# EAGLE design ESP 12F 2x8 pinout (EAGLE 7.7.0)
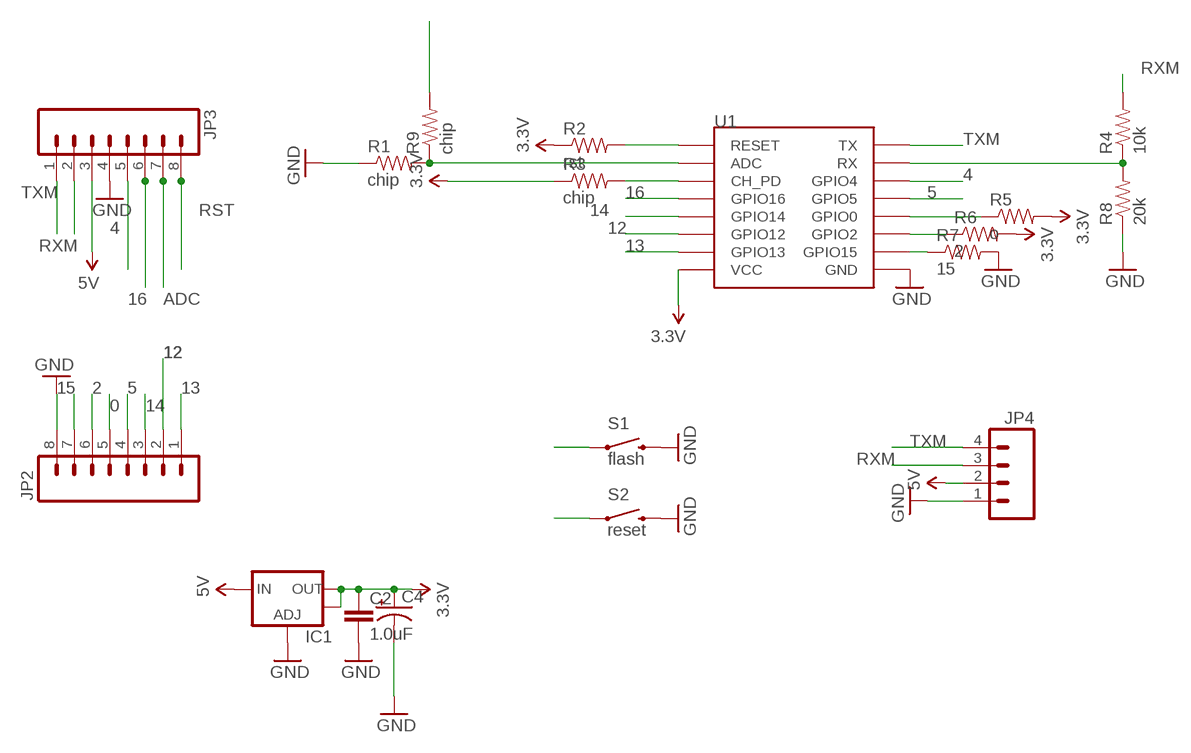
[diagram p0: schematic, sheet 1]

## Parts
C2  1.0uF  1.0UF50V10%(1206)  [1206]
C4  47UF-50V-20%(ELECT)  [PANASONIC_D]
IC1  V_REG_LM1117SOT223  [SOT223]
JP2  M08  [1X08_ROUND]
JP3  M08  [1X08_ROUND]
JP4  M04PTH  [1X04]
R1  chip  0.3OHM-1/8W-1%(0805)  [0805]
R2  rst  0.3OHM-1/8W-1%(0805)  [0805]
R3  chip  0.3OHM-1/8W-1%(0805)  [0805]
R4  10k  0.3OHM-1/8W-1%(0805)  [0805]
R5  o  0.3OHM-1/8W-1%(0805)  [0805]
R6  2  0.3OHM-1/8W-1%(0805)  [0805]
R7  15  0.3OHM-1/8W-1%(0805)  [0805]
R8  20k  0.3OHM-1/8W-1%(0805)  [0805]
R9  chip  0.3OHM-1/8W-1%(0805)  [0805]
S1  flash  SWITCH-MOMENTARY-2SMD-1101NE  [TACTILE-SWITCH-1101NE]
S2  reset  SWITCH-MOMENTARY-2SMD-1101NE  [TACTILE-SWITCH-1101NE]
U1  ESP12SMD  [ESP12-SMD]

## Nets
0: JP2.5 R5.1 S1.1 U1.GPIO0
2: JP2.6 R6.1 U1.GPIO2
3.3V: C2.1 C4.+ IC1.2(OUT) IC1.4(OUT) R2.1 R3.1 R5.2 R6.2 U1.VCC
4: JP3.5 U1.GPIO4
5: JP2.4 U1.GPIO5
5V: IC1.3(IN) JP3.3 JP4.2
12: JP2.2 U1.GPIO12
13: JP2.1 U1.GPIO13
14: JP2.3 U1.GPIO14
15: JP2.7 R7.1 U1.GPIO15
16: JP3.6 U1.GPIO16
ADC: JP3.7 R9.2
ADCM: R1.2 R9.1 U1.ADC
CH_PD: R3.2 U1.CH_PD
GND: C2.2 C4.- IC1.1(ADJ) JP2.8 JP3.4 JP4.1 R1.1 R7.2 R8.1 S1.2 S2.2 U1.GND
N$7: R4.1 R8.2 U1.RXD0(RX)
RST: JP3.8 R2.2 S2.1 U1.RESET
RXM: JP3.2 JP4.3 R4.2
TXM: JP3.1 JP4.4 U1.TXD0(TX)

## Library data of the parts
C2 = SparkFun-Capacitors:1.0UF50V10%(1206): CAP-09822; PROD_ID: CAP-09822
C4 = SparkFun-Capacitors:47UF-50V-20%(ELECT): CAP-10547; PROD_ID: CAP-10547
IC1 = SparkFun-PowerIC:V_REG_LM1117: Voltage Regulator LM1117 Standard adjustable voltage regulator but in SMD form. Spark Fun Electronics SKU : COM-00595; PROD_ID: VREG-08170
JP2 JP3 = SparkFun-Connectors:M08: Header 8 Standard 8-pin 0.1" header. Use with straight break away headers (SKU : PRT-00116), right angle break away headers (PRT-00553), swiss pins (PRT-00743), machine pins (PRT-00117), and female headers (PRT-00115).
JP4 = SparkFun-Connectors:M04: Header 4 Standard 4-pin 0.1" header. Use with straight break away headers (SKU : PRT-00116), right angle break away headers (PRT-00553), swiss pins (PRT-00743), machine pins (PRT-00117), and female headers (PRT-00115). Molex polarized connector foot print use with SKU : PRT-08231 with associated crimp pins and housings. 1MM SMD Version SKU: PRT-10208
R1-R9 = SparkFun-Resistors:0.3OHM-1/8W-1%(0805): RES-11622; PROD_ID: RES-11622; VALUE: 0.3
S1 S2 = SparkFun-Electromechanical:SWITCH-MOMENTARY-2: Various NO switches- pushbuttons, reed, etc; PROD_ID: SWCH-00815
U1 = esp8266modules:ESP12: ESP8266 Wifi module 12

## Board
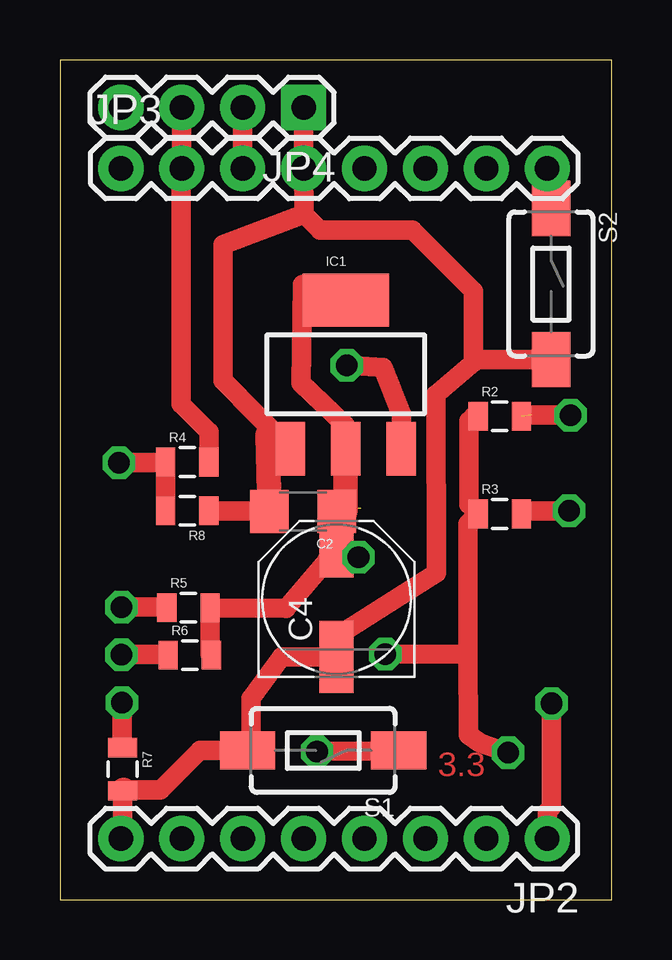
[diagram p1: board, top side]
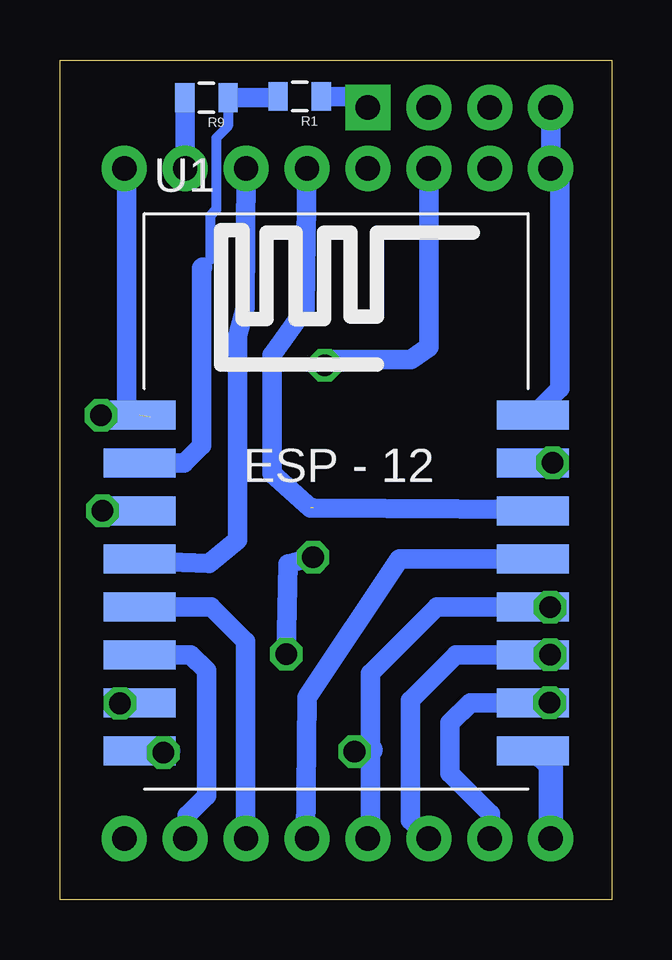
[diagram p2: board, bottom side, seen from below]

Size 23 x 35 mm. Coordinates in mm from the lower left corner, seen from the top.
Outline: 0,0 23,0 23,35 0,35 0,0
Copper layers (1*16): Top 0.035mm / dielectric 1.5mm / Bottom 0.035mm
Design rules "default *": minimum track width 20mil, minimum drill 24mil, track to track 8mil, track to pad 8mil, pad to pad 8mil, via to via 8mil, smd to smd 8mil, copper to edge 40mil, drill to drill 8mil, minimum pad ring 10mil, minimum via ring 8mil, stop-mask expansion 4mil, vias tented up to drill 0mil, thermal gap 10mil

### Footprints (pad centres in the part's own frame; a part is rotated, then mirrored left to right if it is on the bottom)
1206 = smd 1.6 x 1.8: 1 -1.4,0; 2 1.4,0
PANASONIC_D = smd 3 x 1.4: + 2.4,0; - -2.4,0
SOT223 = smd 1.219 x 2.235: 1 -2.311,-3.099; 2 0,-3.099; 3 2.311,-3.099 | smd 3.6 x 2.2: 4 0,3.099
1X08_ROUND = drill 1.016 pad 1.88: 1 0,0; 2 2.54,0; 3 5.08,0; 4 7.62,0; 5 10.16,0; 6 12.7,0; 7 15.24,0; 8 17.78,0
1X04 = drill 1.016 pad 1.88 square: 1 0,0 | drill 1.016 pad 1.88: 2 2.54,0; 3 5.08,0; 4 7.62,0
0805 = smd 0.8 x 1.2: 1 -0.9,0; 2 0.9,0
TACTILE-SWITCH-1101NE = smd 2.3 x 1.6: 1 -3.15,0; 2 3.15,0
ESP12-SMD = smd 3 x 1.2: ADC -8.3,3.8; CH_PD -8.3,1.8; GND 8.1,-8.2; GPIO0 8.1,-2.2; GPIO2 8.1,-4.2; GPIO4 8.1,1.8; GPIO5 8.1,-0.2; GPIO12 -8.3,-4.2; GPIO13 -8.3,-6.2; GPIO14 -8.3,-2.2; GPIO15 8.1,-6.2; GPIO16 -8.3,-0.2; RESET -8.3,5.8; RXD0 8.1,3.8; TXD0 8.1,5.8; VCC -8.3,-8.2

### Placement (x,y rotation side)
C2  10.13,16.18 180 top
C4  11.53,12.52 90 top
IC1  11.91,21.89 0 top
JP2  20.32,2.54 180 top
JP3  2.54,30.48 0 top
JP4  10.16,33.02 180 top
R1  13,33.48 180 bottom
R2  18.34,20.14 0 top
R3  18.34,16.08 0 top
R4  5.31,18.24 0 top
R5  5.36,12.17 0 top
R6  5.41,10.19 0 top
R7  2.62,5.44 270 top
R8  5.31,16.21 180 top
R9  16.89,33.43 180 bottom
S1  10.98,6.22 180 top
S2  20.47,25.66 270 top
U1  11.38,14.4 0 bottom

### Tracks (layer width: path | path; a pad name or v marks a point on that pad's centre or on a via)
0  (via drill 0.9)
  Top 0.813: v2.56,12.19 4.43,12.19 R5.1 | v10.72,6.17 14.11,6.2
  Top 1.016: 14.11,6.2 S1.1
  Bottom 0.813: JP2.5 10.06,2.64 10.06,6.25 10.06,9.42 7.28,12.2 U1.GPIO0 2.58,12.2 v2.56,12.19 | 10.72,6.25 v10.72,6.17
  Bottom 1.016: 10.06,6.25 10.72,6.25
2  (via drill 0.9)
  Top 0.813: v2.56,10.21 4.49,10.21 R6.1
  Bottom 0.813: JP2.6 8.38,3.3 8.38,8.31 6.49,10.2 U1.GPIO2 v2.57,10.2 v2.56,10.21
3.3V  (via drill 0.9)
  Top 0.813: v18.69,6.12 17.5,6.53 17.03,6.87 17.02,10.21 | R2.1 17.25,20.14 17.04,19.94 17.04,16.47 R3.1 17.44,16.07 17.02,15.65 17.02,10.21 | R6.2 6.26,10.24 R5.2 9.42,12.14 11.11,14.11 C4.+ 11.42,14.21 v12.45,14.28 | IC1.2 11.89,19.79 10.06,21.54 10.11,25.63 IC1.4 | v13.56,10.24 17.02,10.21
  Top 1.016: IC1.2 11.91,16.26 | 11.91,16.26 C2.1 | 11.91,16.26 11.89,16.12 C4.+
  Bottom 0.813: U1.VCC 18.39,6.2 v18.69,6.12 | v12.45,14.28 13.49,13.99 v13.56,10.24
4  (1 unrouted)
  Bottom 0.813: 12.42,16.33 3.33,16.26 | JP3.5 12.78,24.61 14.15,22.71 14.15,17.75 12.55,16.33
  Bottom 1.016: 3.33,16.26 U1.GPIO4
5
  Bottom 0.813: U1.GPIO5 8.84,14.2 12.7,8.43 12.75,2.59
  Bottom 1.016: 12.75,2.59 JP2.4
5V  (via drill 0.9)
  Top 0.813: JP4.2 JP3.3 | IC1.3 14.25,18.82 14.25,20.22 13.46,22.17 v11.96,22.28
  Bottom 0.813: JP3.3 7.62,23.04 8.36,22.5 11.89,22.5 v11.96,22.28
12
  Bottom 0.813: U1.GPIO12 17.54,10.2 16.89,9.55 16.89,4.32 17.7,3.5 17.7,2.62 JP2.2
13  (via drill 0.9)
  Top 0.813: JP2.1 20.32,3.66 20.5,3.83 v20.5,8.18
  Bottom 1.016: U1.GPIO13 20.3,8.2 v20.5,8.18
14
  Bottom 0.813: U1.GPIO14 16.7,12.2 15.27,10.77 15.27,2.56
  Bottom 1.016: 15.27,2.56 JP2.3
15  (via drill 0.9)
  Top 0.813: v2.59,8.2 2.59,6.36 R7.1
  Bottom 0.813: JP2.7 5.05,2.56 5.05,3.58 6.73,5.26 6.73,7.37 5.89,8.2 U1.GPIO15 v2.59,8.2
16
  Bottom 0.813: JP3.6 15.29,24.66 15.6,23.5 15.6,14.99 16.79,14.02 19.6,14.12 U1.GPIO16
ADC
  Bottom 0.813: JP3.7 17.78,33.41 R9.2
ADCM
  Bottom 0.406: R9.1 15.99,32.24 16.48,31.75 16.48,28.75 16.74,28.5 16.74,26.67 17.04,26.36
  Bottom 0.813: U1.ADC 17.82,18.2 17.09,18.92 17.09,26.31 17.04,26.36 | R9.1 13.96,33.43 R1.2
CH_PD  (via drill 0.9)
  Top 0.813: v21.23,16.2 19.37,16.2 R3.2
  Bottom 0.813: U1.CH_PD v21.23,16.2
GND
  Top 0.813: R7.2 2.62,2.62 JP2.8 | JP4.1 JP3.4 10.19,28.57 | S1.2 5.84,6.22 4.19,4.57 2.65,4.57 | R8.1 8.4,16.2 | 7.98,6.37 7.98,8.38 9.23,10.12 C4.- 11.53,10.97 15.7,13.61 15.67,21.06 17.25,22.38 | IC1.1 6.81,21.64 6.81,27.3 10.19,28.57 | 17.25,22.38 17.25,25.38 14.71,27.91 10.85,27.91 10.19,28.57 | S2.2 17.38,22.51 17.25,22.38
  Top 1.016: 2.65,4.57 R7.2 | IC1.1 8.66,19.36 C2.2 8.4,16.2 | 7.98,6.37 S1.2
  Bottom 0.813: 2.54,5.46 U1.GND | R1.1 10.62,33.48 JP4.1
  Bottom 1.016: JP2.8 2.54,5.46
N$7  (via drill 0.9)
  Top 0.813: R8.2 R4.1 4.38,18.21 v2.46,18.21
  Bottom 0.813: U1.RXD0 2.47,18.2 v2.46,18.21
RST  (via drill 0.9)  (1 unrouted)
  Top 0.813: v21.29,20.19 19.71,20.19 | JP3.8 20.32,28.97 S2.1
  Bottom 0.813: v21.29,20.19 21.28,20.2 U1.RESET 21.14,20.2 20.22,20.37 20.22,29.59 JP3.8
RXM
  Top 0.813: R4.2 6.21,19.5 5.05,20.65 5.05,30.45 JP3.2 JP4.3
TXM
  Bottom 0.813: U1.TXD0 3.27,20.2 2.16,21.31 2.16,30.1 JP3.1 JP4.4

### Text on the board
Top: 3.3